# Altium schematic sheet Crawler_Power_V2.0.SchDoc
size A3; SheetNumber: 1; SheetTotal: 2
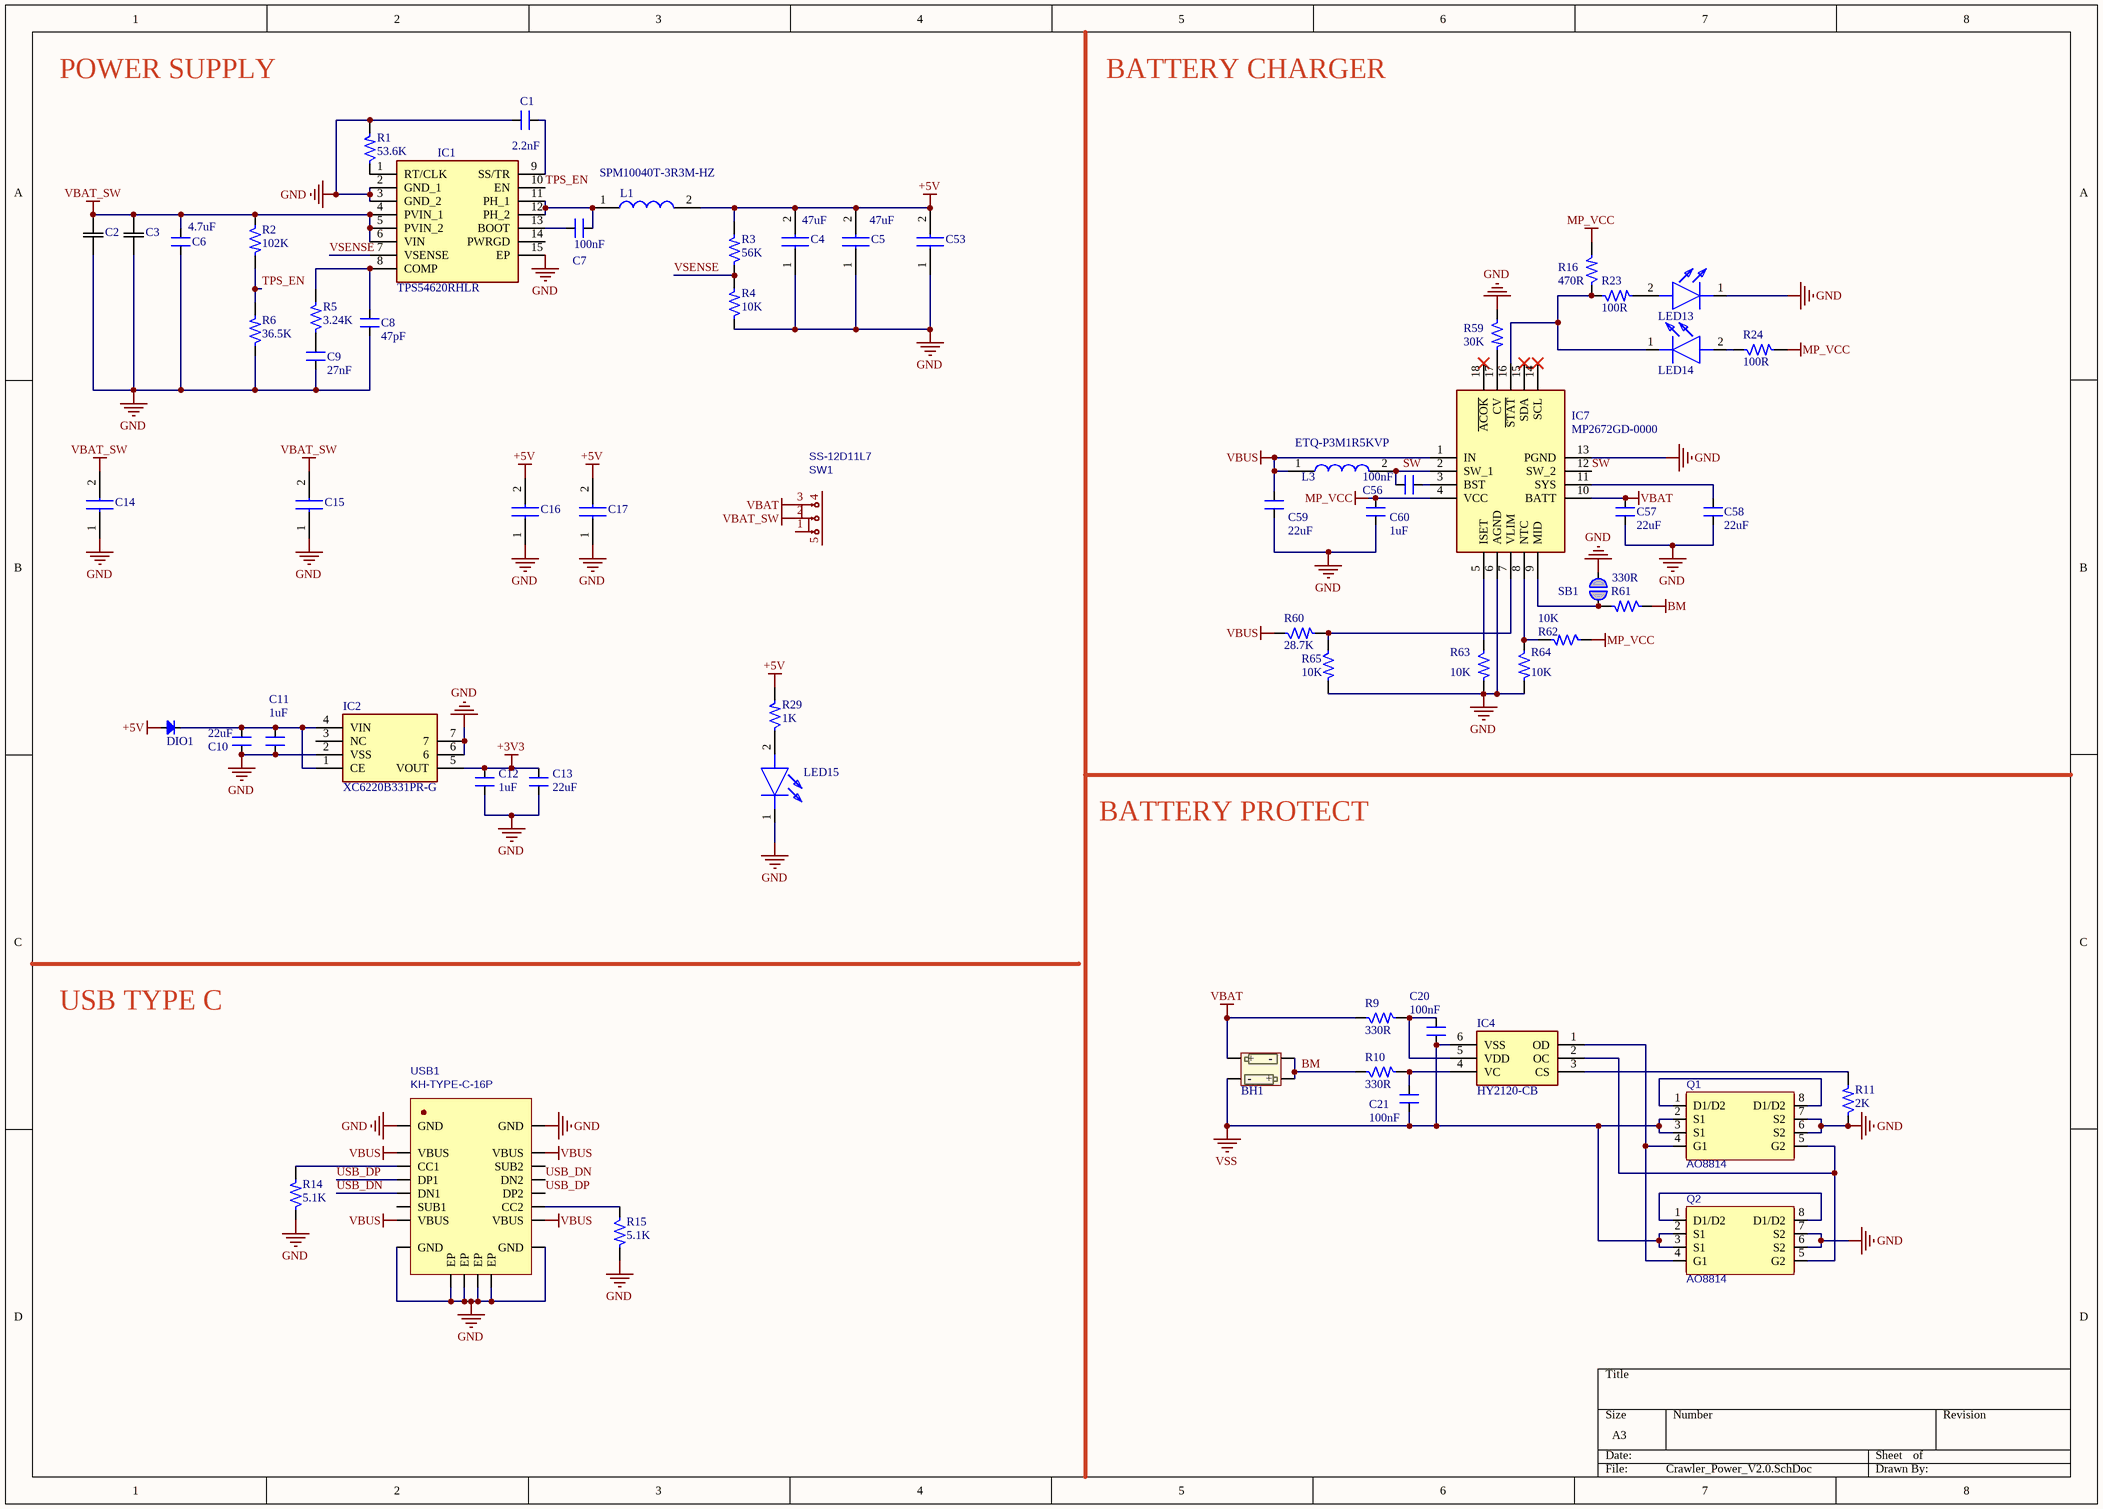
[diagram p0: Crawler_Power_V2.0.SchDoc]

## Parts
BH1  Battery Holder  [BH-18650-B1BA007]  (value not drawn)
C1  2.2nF  [CAP_0402]
C2  CC1206MKX5R7BB106  [CAP_CC1206_YAG-M]  (value not drawn)
C3  CC1206MKX5R7BB106  [CAP_CC1206_YAG-M]  (value not drawn)
C4  GRM32ER61C476KE15L  [CAPC3225X270N]  (value not drawn)
C5  GRM32ER61C476KE15L  [CAPC3225X270N]  (value not drawn)
C6  4.7uF  [CAP_0402]
C7  100nF  [CAP_0603]
C8  47pF  [CAP_0402]
C9  27nF  [CAP_0402]
C10  22uF  [CAP_0603]
C11  1uF  [CAP_0402]
C12  1uF  [CAP_0402]
C13  22uF  [CAP_0603]
C14  GRM32ER61C476KE15L  [CAPC3225X270N]  (value not drawn)
C15  GRM32ER61C476KE15L  [CAPC3225X270N]  (value not drawn)
C16  GRM32ER61C476KE15L  [CAPC3225X270N]  (value not drawn)
C17  GRM32ER61C476KE15L  [CAPC3225X270N]  (value not drawn)
C20  100nF  [CAP_0402]
C21  100nF  [CAP_0402]
C53  GRM32ER61C476KE15L  [CAPC3225X270N]  (value not drawn)
C56  100nF  [CAP_0603]
C57  22uF  [CAP_0805]
C58  22uF  [CAP_0805]
C59  22uF  [CAP_0603]
C60  1uF  [CAP_0402]
DIO1  Diode SMD  [DIO-SMD-123]  (value not drawn)
IC1  TPS54620RHLR  [TPS54622RHLR]
IC2  XC6220B331PR-G  [XC6220B331PRG]
IC4  HY2120-CB  [SOT95P280X140-6N]
IC7  MP2672GD-0000  [QFN40P200X300X100-18N-D]
L1  SPM10040T-3R3M-HZ  [SPM10040]
L3  ETQ-P3M1R5KVP  [ETQ-P3M_KVP]
LED13  LTST-C191KGKT  [LEDC1608X55N]  (value not drawn)
LED14  LTST-C190KRKT  [LEDC1608X80N]  (value not drawn)
LED15  LTST-C191KGKT  [LEDC1608X55N]  (value not drawn)
Q1  AO8814  [TSSOP-8_L4.4-W3.0-P0.65-LS6.4-BL]
Q2  AO8814  [TSSOP-8_L4.4-W3.0-P0.65-LS6.4-BL]
R1  53.6K  [RES_0402]
R2  102K  [RES_0402]
R3  56K  [RES_0402]
R4  10K  [RES_0402]
R5  3.24K  [RES_0402]
R6  36.5K  [RES_0402]
R9  330R  [RES_0402]
R10  330R  [RES_0402]
R11  2K  [RES_0402]
R14  5.1K  [RES_0402]
R15  5.1K  [RES_0402]
R16  470R  [RES_0402]
R23  100R  [RES_0402]
R24  100R  [RES_0402]
R29  1K  [RES_0402]
R59  30K  [RES_0402]
R60  28.7K  [RES_0402]
R61  330R  [RES_0402]
R62  10K  [RES_0402]
R63  10K  [RES_0402]
R64  10K  [RES_0402]
R65  10K  [RES_0402]
SB1  Solderbridge  [Solderbridge]  (value not drawn)  (no BOM)
SW1  SS-12D11L7  [SW-TH_XKB_SS-12D11L7]
USB1  KH-TYPE-C-16P  [USB-C-SMD_KH-TYPE-C-16P]

## Nets
+3V3: C12.2 C13.2 IC2.5(VOUT)
+5V: C4.2 C5.2 C16.2 C17.2 C53.2 DIO1.1(A) L1.2 R3.2 R29.2
BM: BH1.2(-) BH1.4(+) R10.1 R61.1
GND: C1.2 C2.1 C3.1 C4.1 C5.1 C6.1 C8.1 C9.1 C10.1 C11.1 C12.1 C13.1 C14.1 C15.1 C16.1 C17.1 C53.1 C57.1 C58.1 C59.1 C60.1 IC1.2(GND_1) IC1.3(GND_2) IC1.15(EP) IC2.2(VSS) IC2.6 IC2.7 IC7.6(AGND) IC7.13(PGND) LED13.1(K) LED15.1(K) Q1.6(S2) Q1.7(S2) Q2.6(S2) Q2.7(S2) R1.2 R4.1 R6.1 R11.1 R14.1 R15.2 R59.1 R63.2 R64.2 R65.2 SB1.2 USB1.1(EP) USB1.2(EP) USB1.3(EP) USB1.4(EP) USB1.A1(GND) USB1.A12(GND) USB1.B1(GND) USB1.B12(GND)
MP_VCC: C60.2 IC7.4(VCC) R16.2 R24.2 R62.1
VBAT: BH1.1(+) C57.2 IC7.10(BATT) R9.1 SW1.3
VBAT_SW: C2.2 C3.2 C6.2 C14.2 C15.2 IC1.4(PVIN_1) IC1.5(PVIN_2) IC1.6(VIN) R2.1 SW1.2
VBUS: C59.2 IC7.1(IN) L3.1 R60.1 USB1.A4(VBUS) USB1.A9(VBUS) USB1.B4(VBUS) USB1.B9(VBUS)
VSS: BH1.3(-) C20.2 C21.1 IC4.6(VSS) Q1.2(S1) Q1.3(S1) Q2.2(S1) Q2.3(S1)
SW: C56.1 IC7.2(SW_1) IC7.12(SW_2) L3.2
TPS_EN: IC1.10(EN) R2.2 R6.2
USB_DN: USB1.A7(DN1) USB1.B7(DN2)
USB_DP: USB1.A6(DP1) USB1.B6(DP2)
VSENSE: IC1.7(VSENSE) R3.1 R4.2
NetC1_1: C1.1 IC1.9(SS/TR)
NetC7_1: C7.1 IC1.13(BOOT)
NetC7_2: C7.2 IC1.11(PH_1) IC1.12(PH_2) L1.1
NetC8_2: C8.2 IC1.8(COMP) R5.2
NetC9_2: C9.2 R5.1
NetC10_2: C10.2 C11.2 DIO1.2(K) IC2.1(CE) IC2.4(VIN)
NetC20_1: C20.1 IC4.5(VDD) R9.2
NetC21_2: C21.2 IC4.4(VC) R10.2
NetC56_2: C56.2 IC7.3(BST)
NetC58_2: C58.2 IC7.11(SYS)
NetIC1_1: IC1.1(RT/CLK) R1.1
NetIC4_1: IC4.1(OD) Q1.4(G1) Q2.4(G1)
NetIC4_2: IC4.2(OC) Q1.5(G2) Q2.5(G2)
NetIC4_3: IC4.3(CS) R11.2
NetIC7_5: IC7.5(ISET) R63.1
NetIC7_7: IC7.7(VLIM) R60.2 R65.1
NetIC7_8: IC7.8(NTC) R62.2 R64.1
NetIC7_9: IC7.9(MID) R61.2 SB1.1
NetIC7_16: IC7.16(~{STAT}) LED14.1(K) R16.1 R23.1
NetIC7_17: IC7.17(CV) R59.2
NetLED13_2: LED13.2(A) R23.2
NetLED14_2: LED14.2(A) R24.1
NetLED15_2: LED15.2(A) R29.1
NetQ1_1: Q1.1(D1/D2) Q1.8(D1/D2)
NetQ2_1: Q2.1(D1/D2) Q2.8(D1/D2)
NetR14_2: R14.2 USB1.A5(CC1)
NetR15_1: R15.1 USB1.B5(CC2)

Not connected (* = marked no-connect by the designer): IC1 14(PWRGD); IC2 3(NC); IC7 14(SCL)* 15(SDA)* 18(~{ACOK})*; SW1 1 4 5; USB1 A8(SUB1) B8(SUB2)

## Notes on the sheet
- POWER SUPPLY
- BATTERY CHARGER
- (near C4) 47uF
- (near C5) 47uF
- BATTERY PROTECT
- USB TYPE C

## Library data of the parts
BH1 = BH-18650-B1BA007
C1 = CAP_220pF-10V-10%-0402: 2.2nF ±10% 50V Ceramic Capacitor X7R 0402 (1005 Metric); Manufacturer: KEMET; Manufacturer Part Number: C0402C221K8RAC7867; Case/Package: 0402; Supplier-1: Digikey
C2 C3 = CC1206MKX5R7BB106: No Description Available; Mfr_Name: Yageo; Type: DEV; Copyright: Copyright (C) 2023 Ultra Librarian. All rights reserved.; Manufacturer_Part_Number: CC1206MKX5R7BB106; Digi-Key_Part_Number_1: 311-1996-2-ND; Digi-Key_Part_Number_2: 311-1996-1-ND; Digi-Key_Part_Number_3: 311-1996-6-ND; RefDes: RefDes
C4 C5 C14-C17 C53 = GRM32ER61C476KE15L: Capacitor; Manufacturer_Name: Murata Electronics; Datasheet Link: http://psearch.en.murata.com/capacitor/product/GRM32ER71E226KE15%23.pdf; Height: 2.7mm; Manufacturer_Part_Number: GRM32ER61C476KE15L; Arrow Part Number: GRM32ER61C476KE15L; Arrow Price/Stock: https://www.arrow.com/en/products/grm32er61c476ke15l/murata-manufacturing; Mouser Part Number: 81-GRM32ER61C476KE5L; Mouser Price/Stock: https://www.mouser.co.uk/ProductDetail/Murata-Electronics/GRM32ER61C476KE15L?qs=%252B%2F7tQhzlcy7Im%2F1Gh2YSGQ%3D%3D
C6 = CAP_4.7uF-10V-10%-0402: 4.7µF ±10% 10V Ceramic Capacitor X5R 0402 (1005 Metric); Manufacturer: Samsung Electro-Mechanics; Manufacturer Part Number: CL05A475KP5NRNC; Case/Package: 0402; Supplier-1: Digikey
C7 C56 = CAP_100nF-10V-5%-0603: 25V 100nF X7R ±10% 0603 Multilayer Ceramic Capacitors MLCC - SMD/SMT ROHS; Manufacturer: Yageo; Manufacturer Part Number: CC0603KRX7R6BB104; Case/Package: 0603; Supplier-1: Digikey
C8 = CAP_220pF-10V-10%-0402: 82pF ±10% 50V Ceramic Capacitor NP0 0402 (1005 Metric); Manufacturer: KEMET; Manufacturer Part Number: C0402C221K8RAC7867; Case/Package: 0402; Supplier-1: Digikey
C9 = CAP_220pF-10V-10%-0402: 27nF ±10% 50V Ceramic Capacitor X7R 0402 (1005 Metric); Manufacturer: KEMET; Manufacturer Part Number: C0402C221K8RAC7867; Case/Package: 0402; Supplier-1: Digikey
C10 C13 C59 = CAP_22uF-10V-20%-0603: 22µF ±20% 10V Ceramic Capacitor X5R 0603 (1608 Metric); Manufacturer: Murata Electronics; Manufacturer Part Number: GRM188R61A226ME15D; Case/Package: 0603; Supplier-1: Digikey
C11 C12 C60 = CAP_1uF-10V-10%-0402: 1µF ±10% 10V Ceramic Capacitor X6S 0402 (1005 Metric); Manufacturer: Murata Electronics; Manufacturer Part Number: GRT155C81A105KE01D; Case/Package: 0402; Supplier-1: Digikey
C20 C21 = CAP_100nF-25V-10%-0402: 0.1µF ±10% 25V Ceramic Capacitor X7R 0402 (1005 Metric); Manufacturer: Walsin Technology Corporation; Manufacturer Part Number: 0402B104K250CT; Case/Package: 0402; Supplier-1: Digikey
C57 C58 = CAP_22uF-25V-20%-0805: 22µF ±20% 25V Ceramic Capacitor X5R 0805 (2012 Metric); Manufacturer: Murata Electronics; Manufacturer Part Number: GRM21BR61E226ME44K; Case/Package: 0805; Supplier-1: Digikey
DIO1 = Diode SMD: Default Diode; Code - JEDEC: DO-214-AB; Value: 1N5007; Published: 8-Jun-2000; Revision: July-2002: Re-released for DXP Platform.; Publisher: Altium Limited
IC1 = TPS54620RHLR: Integrated Circuit; Manufacturer_Name: Texas Instruments; Datasheet Link: http://www.ti.com/lit/ds/symlink/tps54620.pdf; Manufacturer_Part_Number: TPS54620RHLR; Mouser Part Number: 595-TPS54620RHLR; Mouser Price/Stock: https://www.mouser.co.uk/ProductDetail/Texas-Instruments/TPS54620RHLR?qs=g5raLcSarOavNbXjatBJuw%3D%3D; Arrow Part Number: TPS54620RHLR; Arrow Price/Stock: https://www.arrow.com/en/products/tps54620rhlr/texas-instruments?region=nac
IC2 = XC6220B331PR-G: Integrated Circuit; Manufacturer_Name: Torex; Datasheet Link: https://www.torexsemi.com/file/xc6220/XC6220.pdf; Height: 1.6mm; Manufacturer_Part_Number: XC6220B331PR-G; Mouser Part Number: 865-XC6220B331PR-G; Mouser Price/Stock: https://www.mouser.co.uk/ProductDetail/Torex-Semiconductor/XC6220B331PR-G?qs=AsjdqWjXhJ9%2FMkHVs5v3gw%3D%3D
IC4 = HY2120-CB: Integrated Circuit; Manufacturer_Name: Hycon; Datasheet Link: https://datasheet.lcsc.com/szlcsc/HYCON-Tech-HY2120CB_C116509.pdf; Height: 1.4mm; Manufacturer_Part_Number: HY2120-CB
IC7 = MP2672GD-0000: Integrated Circuit; Manufacturer_Name: Monolithic Power Systems (MPS); Height: 1mm; Manufacturer_Part_Number: MP2672GD-0000
L1 = SPM10040T-3R3M-HZ: Inductor; Manufacturer_Name: TDK; Datasheet Link: https://product.tdk.com/system/files/dam/doc/product/inductor/inductor/smd/catalog/inductor_automotive_power_spm10040-hz_en.pdf; Manufacturer_Part_Number: SPM10040T-3R3M-HZ; Mouser Part Number: 810-SPM10040T-3R3HZ; Mouser Price/Stock: https://www.mouser.co.uk/ProductDetail/TDK/SPM10040T-3R3M-HZ?qs=y6ZabgHbY%252BwBR7hmhWa%252BrA%3D%3D; Arrow Part Number: SPM10040T-3R3M-HZ; Arrow Price/Stock: https://www.arrow.com/en/products/spm10040t-3r3m-hz/tdk?region=nac
L3 = ETQ-P3M1R5KVP: Inductor; Manufacturer_Name: Panasonic; Datasheet Link: http://industrial.panasonic.com/cdbs/www-data/pdf/AGL0000/AGL0000C63.pdf; Height: 3mm; Manufacturer_Part_Number: ETQ-P3M1R5KVP; Mouser Part Number: 667-ETQ-P3M1R5KVP; Mouser Price/Stock: https://www.mouser.co.uk/ProductDetail/Panasonic/ETQ-P3M1R5KVP?qs=DddhjTRTMKyw4jpGRX4KaA%3D%3D; Arrow Part Number: ETQ-P3M1R5KVP; Arrow Price/Stock: https://www.arrow.com/en/products/etq-p3m1r5kvp/panasonic
LED13 LED15 = LTST-C191KGKT: LED GREEN; Manufacturer_Name: Lite-On; Datasheet Link: http://www.mouser.com/ds/2/239/S_110_LTST-C191KGKT-369560.pdf; Height: 0.55mm; Manufacturer_Part_Number: LTST-C191KGKT; Mouser Part Number: 859-LTST-C191KGKT; Mouser Price/Stock: https://www.mouser.co.uk/ProductDetail/Lite-On/LTST-C191KGKT?qs=xSPZu9B1aMCRQ5ACasEYAg%3D%3D; Arrow Part Number: LTST-C191KGKT; Arrow Price/Stock: https://www.arrow.com/en/products/ltst-c191kgkt/lite-on-technology?region=nac
LED14 = LTST-C190KRKT: LED RED; Manufacturer_Name: Lite-On; Datasheet Link: https://componentsearchengine.com/Datasheets/1/LTST-C190KRKT.pdf; Height: 0.8mm; Manufacturer_Part_Number: LTST-C190KRKT; Mouser Part Number: 859-LTST-C190KRKT; Mouser Price/Stock: https://www.mouser.co.uk/ProductDetail/Lite-On/LTST-C190KRKT?qs=kAD5fFa1n5VY3YYNWPC1Fg%3D%3D; Arrow Part Number: LTST-C190KRKT; Arrow Price/Stock: https://www.arrow.com/en/products/ltst-c190krkt/lite-on-technology?region=europe
Q1 Q2 = AO8814: BOM_Manufacturer: AOS; Contributor: LCSC; BOM_Supplier: LCSC; BOM_Supplier Part: C357843; BOM_Manufacturer Part: AO8814; BOM_JLCPCB Part Class: Extended Part; spicePre: Q; spiceSymbolName: AO8814
R1 = RES_300K-0.1W-1%-0402: 53.6 kOhms ±1% 0.1W, 1/10W Chip Resistor 0402 (1005 Metric) Automotive AEC-Q200 Thick Film; Manufacturer: Panasonic Electronic Components; Manufacturer Part Number: ERJ-2RKF3003X; Case/Package: 0402; Supplier-1: Digikey
R2 = RES_300K-0.1W-1%-0402: 102 kOhms ±1% 0.1W, 1/10W Chip Resistor 0402 (1005 Metric) Automotive AEC-Q200 Thick Film; Manufacturer: Panasonic Electronic Components; Manufacturer Part Number: ERJ-2RKF3003X; Case/Package: 0402; Supplier-1: Digikey
R3 = RES_51K-0.1W-1%-0402: 56 kOhms ±1% 0.1W, 1/10W Chip Resistor 0402 (1005 Metric) Automotive AEC-Q200 Thick Film; Manufacturer: Panasonic Electronic Components; Manufacturer Part Number: ERJ-2RKF5102X; Case/Package: 0402; Supplier-1: Digikey
R4 R62-R65 = RES_10K-0.1W-1%-0402: 10 kOhms ±1% 0.1W, 1/10W Chip Resistor 0402 (1005 Metric) Anti-Sulfur Thin Film; Manufacturer: Vishay Beyschlag/Draloric/BC Components; Manufacturer Part Number: MCS04020C1002FE000; Case/Package: 0402; Supplier-1: Digikey
R5 = RES_300K-0.1W-1%-0402: 3.24 kOhms ±1% 0.1W, 1/10W Chip Resistor 0402 (1005 Metric) Automotive AEC-Q200 Thick Film; Manufacturer: Panasonic Electronic Components; Manufacturer Part Number: ERJ-2RKF3003X; Case/Package: 0402; Supplier-1: Digikey
R6 = RES_300K-0.1W-1%-0402: 28.7 kOhms ±1% 0.1W, 1/10W Chip Resistor 0402 (1005 Metric) Automotive AEC-Q200 Thick Film; Manufacturer: Panasonic Electronic Components; Manufacturer Part Number: ERJ-2RKF3003X; Case/Package: 0402; Supplier-1: Digikey
R9 R10 R61 = RES_300K-0.1W-1%-0402: 330 Ohms ±1% 0.1W, 1/10W Chip Resistor 0402 (1005 Metric) Automotive AEC-Q200 Thick Film; Manufacturer: Panasonic Electronic Components; Manufacturer Part Number: ERJ-2RKF3003X; Case/Package: 0402; Supplier-1: Digikey
R11 = RES_200K-0.1W-1%-0402: 2 kOhms ±1% 0.1W, 1/10W Chip Resistor 0402 (1005 Metric) Automotive AEC-Q200 Thick Film; Manufacturer: Panasonic Electronic Components; Manufacturer Part number: ERJ-2RKF2003X; Case/Package: 0402; Supplier-1: Digikey
R14 R15 = RES_5.6K-0.1W-1%-0402: 5.1 kOhms ±1% 0.1W, 1/10W Chip Resistor 0402 (1005 Metric) Automotive AEC-Q200, Moisture Resistant Thick Film; Manufacturer: KOA Speer Electronics, Inc.; Manufacturer Part Number: RK73H1ETTP5601F; Case/Package: 0402; Supplier-1: Digikey
R16 = RES_100R-0.1W-1%-0402: 470 Ohms ±1% 0.1W, 1/10W Chip Resistor 0402 (1005 Metric) Automotive AEC-Q200, Moisture Resistant Thick Film; Manufacturer: KOA Speer Electronics, Inc.; Manufacturer Part Number: RK73H1ETTP1000F; Case/Package: 0402; Supplier-1: Digikey
R23 R24 = RES_100R-0.1W-1%-0402: 100 Ohms ±1% 0.1W, 1/10W Chip Resistor 0402 (1005 Metric) Automotive AEC-Q200, Moisture Resistant Thick Film; Manufacturer: KOA Speer Electronics, Inc.; Manufacturer Part Number: RK73H1ETTP1000F; Case/Package: 0402; Supplier-1: Digikey
R29 = RES_1K-0.1W-1%-0402: 1 kOhms ±1% 0.1W, 1/10W Chip Resistor 0402 (1005 Metric) Anti-Sulfur Thin Film; Manufacturer: Vishay Beyschlag/Draloric/BC Components; Manufacturer Part Number: MCS04020C1001FE000; Case/Package: 0402; Supplier-1: Digikey
R59 = RES_10K-0.1W-1%-0402: 30 kOhms ±1% 0.1W, 1/10W Chip Resistor 0402 (1005 Metric) Anti-Sulfur Thin Film; Manufacturer: Vishay Beyschlag/Draloric/BC Components; Manufacturer Part Number: MCS04020C1002FE000; Case/Package: 0402; Supplier-1: Digikey
R60 = RES_10K-0.1W-1%-0402: 28.7 kOhms ±1% 0.1W, 1/10W Chip Resistor 0402 (1005 Metric) Anti-Sulfur Thin Film; Manufacturer: Vishay Beyschlag/Draloric/BC Components; Manufacturer Part Number: MCS04020C1002FE000; Case/Package: 0402; Supplier-1: Digikey
SB1 = SOLDERBRIDGE: Artikkelnr Noca: N.A.; Part Number: Solderbridge; Manufacturer: *; Manufacturer Part Number: *; LatestRevisionDate: 2009-12-14; Pin Count: 2; Publisher: Nordic Semiconductor; Published: 2009-12-14; Value: Solderbridge; Note: *; Footprint Doc: Solderbridge; Part number IPS: N.A.; ComponentLink1URL: *; ComponentLink1Description: Datasheet; ComponentLink2URL: *; ComponentLink2Description: Supplier link; HelpURL: *; Supplier 1: *; Supplier Part Number 1: *; Supplier 2: *; Supplier Part Number 2: *
SW1 = SS-12D11L7: BOM_Manufacturer: XKB Connectivity(中国星坤); Contributor: LCSC; BOM_Supplier: LCSC; BOM_Supplier Part: C2884775; BOM_Manufacturer Part: SS-12D11L7; BOM_JLCPCB Part Class: Extended Part; spicePre: S; spiceSymbolName: SS-12D11L7
USB1 = KH-TYPE-C-16P: BOM_Manufacturer: kinghelm(金航标); Contributor: LCSC; BOM_Supplier: LCSC; BOM_Supplier Part: C709357; BOM_Manufacturer Part: KH-TYPE-C-16P; BOM_JLCPCB Part Class: Extended Part; spicePre: U; spiceSymbolName: KH-TYPE-C-16P